# EAGLE design shift-in-midi (EAGLE 6.1)
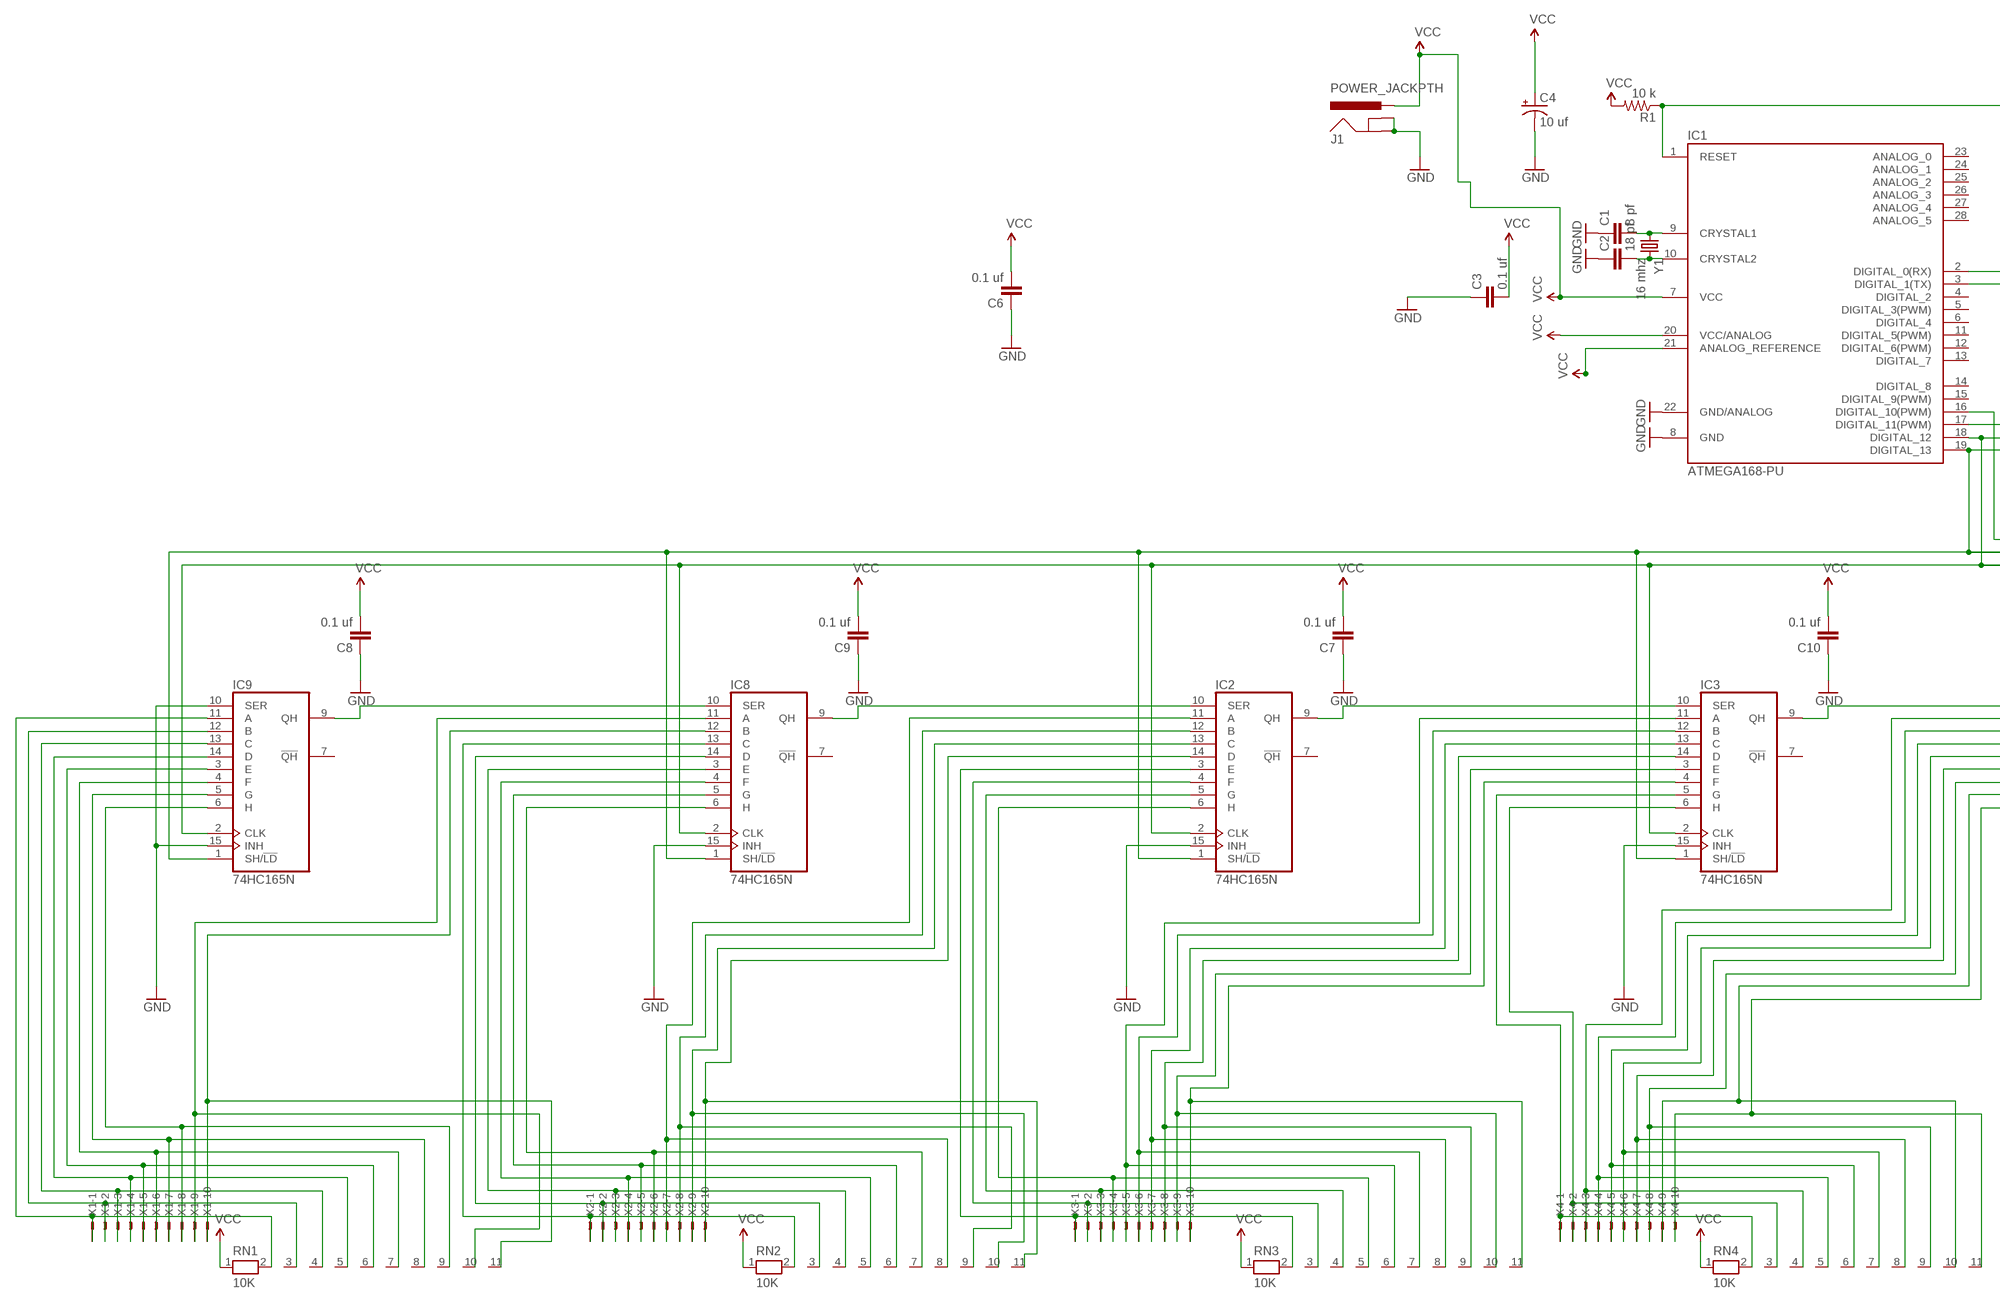
[diagram p0: schematic, sheet 1, part 1 of 2]
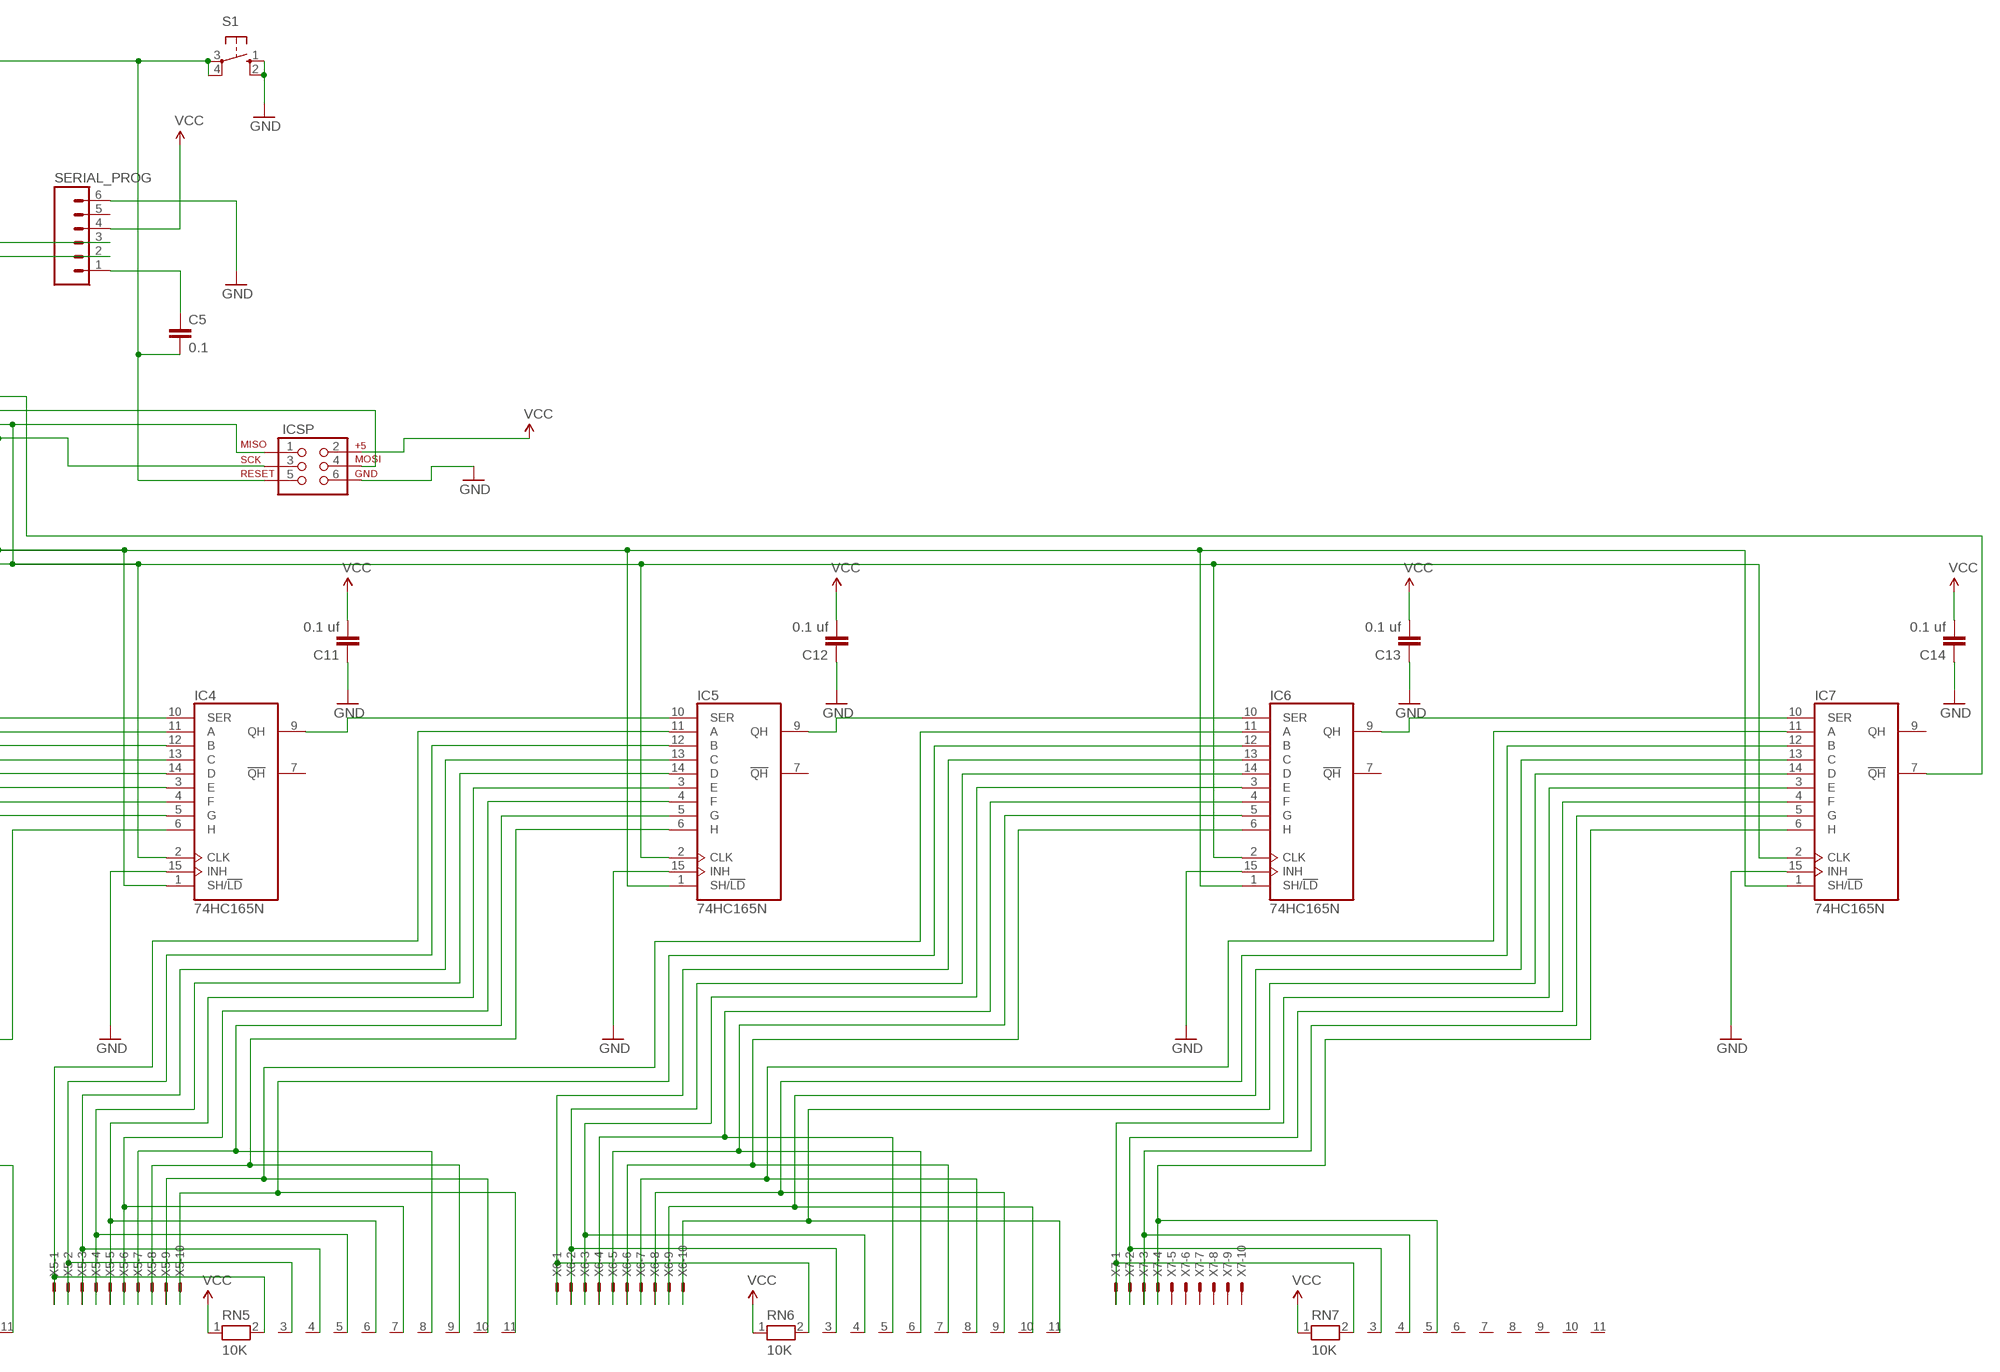
[diagram p1: schematic, sheet 1, part 2 of 2]

## Parts
C1  8 pf  CAPPTH2  [CAP-PTH-SMALL2]
C2  18 pf  CAPPTH2  [CAP-PTH-SMALL2]
C3  0.1 uf  CAPPTH2  [CAP-PTH-SMALL2]
C4  10 uf  CAP_POLPTH2  [CPOL-RADIAL-10UF-25V]
C5  0.1  CAPPTH  [CAP-PTH-SMALL]
C6  0.1 uf  CAPPTH2  [CAP-PTH-SMALL2]
C7  0.1 uf  CAPPTH2  [CAP-PTH-SMALL2]
C8  0.1 uf  CAPPTH2  [CAP-PTH-SMALL2]
C9  0.1 uf  CAPPTH2  [CAP-PTH-SMALL2]
C10  0.1 uf  CAPPTH2  [CAP-PTH-SMALL2]
C11  0.1 uf  CAPPTH2  [CAP-PTH-SMALL2]
C12  0.1 uf  CAPPTH2  [CAP-PTH-SMALL2]
C13  0.1 uf  CAPPTH2  [CAP-PTH-SMALL2]
C14  0.1 uf  CAPPTH2  [CAP-PTH-SMALL2]
IC1  ATMEGA168-PU  [DIL28-3]
IC2  74HC165N  [DIL16]
IC3  74HC165N  [DIL16]
IC4  74HC165N  [DIL16]
IC5  74HC165N  [DIL16]
IC6  74HC165N  [DIL16]
IC7  74HC165N  [DIL16]
IC8  74HC165N  [DIL16]
IC9  74HC165N  [DIL16]
ICSP  AVR_SPI_PRG_62X3_LOCK  [2X3_LOCK]
J1  POWER_JACKPTH  [POWER_JACK_PTH]
R1  10 k  RESISTORPTH-1/4W  [AXIAL-0.4]
RN1  10K  RN10  [RN-11]
RN2  10K  RN10  [RN-11]
RN3  10K  RN10  [RN-11]
RN4  10K  RN10  [RN-11]
RN5  10K  RN10  [RN-11]
RN6  10K  RN10  [RN-11]
RN7  10K  RN10  [RN-11]
S1  10-XX  [B3F-10XX]
SERIAL_PROG  M06LONGPADS  [1X06_LONGPADS]
X1  KK-156-10  [KK-156-10]
X2  KK-156-10  [KK-156-10]
X3  KK-156-10  [KK-156-10]
X4  KK-156-10  [KK-156-10]
X5  KK-156-10  [KK-156-10]
X6  KK-156-10  [KK-156-10]
X7  KK-156-10  [KK-156-10]
Y1  16 mhz  CRYSTALHC49US  [HC49US]

## Nets
GND: C1.1 C2.1 C3.1 C4.2(-) C6.1 C7.1 C8.1 C9.1 C10.1 C11.1 C12.1 C13.1 C14.1 IC1.8(GND) IC1.22(GND/ANALOG) IC2.15(INH) IC3.15(INH) IC4.15(INH) IC5.15(INH) IC6.15(INH) IC7.15(INH) IC8.15(INH) IC9.10(SER) IC9.15(INH) ICSP.6 J1.GND J1.GNDBREAK S1.1(S) S1.2(S1) SERIAL_PROG.6
N$1: C5.2 IC1.1(RESET) ICSP.5 R1.P$1 S1.3(P) S1.4(P1)
N$2: IC1.19(DIGITAL_13) IC2.1(SH/!LD) IC3.1(SH/!LD) IC4.1(SH/!LD) IC5.1(SH/!LD) IC6.1(SH/!LD) IC7.1(SH/!LD) IC8.1(SH/!LD) IC9.1(SH/!LD) ICSP.3
N$3: C1.2 IC1.9(CRYSTAL1) Y1.1
N$4: C2.2 IC1.10(CRYSTAL2) Y1.2
N$5: IC8.10(SER) IC9.9(QH)
N$6: IC2.10(SER) IC8.9(QH)
N$7: C5.1 SERIAL_PROG.1
N$8: IC1.18(DIGITAL_12) IC2.2(CLK) IC3.2(CLK) IC4.2(CLK) IC5.2(CLK) IC6.2(CLK) IC7.2(CLK) IC8.2(CLK) IC9.2(CLK) ICSP.1
N$9: IC1.2(DIGITAL_0(RX)) SERIAL_PROG.3
N$10: IC1.3(DIGITAL_1(TX)) SERIAL_PROG.2
N$11: IC2.9(QH) IC3.10(SER)
N$12: IC3.9(QH) IC4.10(SER)
N$13: IC4.9(QH) IC5.10(SER)
N$14: IC5.9(QH) IC6.10(SER)
N$15: IC6.9(QH) IC7.10(SER)
N$16: IC1.17(DIGITAL_11(PWM)) ICSP.4
N$17: IC1.16(DIGITAL_10(PWM)) IC7.7(!QH)
N$18: IC9.11(A) RN1.2 X1.1
N$19: IC9.12(B) RN1.3 X1.2
N$20: IC9.13(C) RN1.4 X1.3
N$21: IC8.12(B) RN1.11 X1.10
N$22: IC9.3(E) RN1.6 X1.5
N$23: IC9.4(F) RN1.7 X1.6
N$24: IC9.5(G) RN1.8 X1.7
N$25: IC9.6(H) RN1.9 X1.8
N$26: IC8.11(A) RN1.10 X1.9
N$28: IC8.13(C) RN2.2 X2.1
N$29: IC8.14(D) RN2.3 X2.2
N$30: IC8.3(E) RN2.4 X2.3
N$31: IC8.4(F) RN2.5 X2.4
N$32: IC8.5(G) RN2.6 X2.5
N$33: IC4.6(H) RN4.11 X4.10
N$34: IC2.11(A) RN2.8 X2.7
N$35: IC2.12(B) RN2.9 X2.8
N$36: IC2.13(C) RN2.10 X2.9
N$37: IC2.14(D) RN2.11 X2.10
N$38: IC2.3(E) RN3.2 X3.1
N$39: IC2.4(F) RN3.3 X3.2
N$40: IC2.5(G) RN3.4 X3.3
N$41: IC2.6(H) RN3.5 X3.4
N$42: IC3.11(A) RN3.6 X3.5
N$43: IC3.12(B) RN3.7 X3.6
N$44: IC3.13(C) RN3.8 X3.7
N$45: IC3.14(D) RN3.9 X3.8
N$46: IC3.3(E) RN3.10 X3.9
N$47: IC3.4(F) RN3.11 X3.10
N$48: IC3.5(G) RN4.2 X4.1
N$49: IC3.6(H) RN4.3 X4.2
N$50: IC4.11(A) RN4.4 X4.3
N$51: IC4.12(B) RN4.5 X4.4
N$52: IC4.13(C) RN4.6 X4.5
N$53: IC4.14(D) RN4.7 X4.6
N$54: IC4.3(E) RN4.8 X4.7
N$55: IC4.4(F) RN4.9 X4.8
N$56: IC4.5(G) RN4.10 X4.9
N$58: IC5.11(A) RN5.2 X5.1
N$59: IC5.12(B) RN5.3 X5.2
N$60: IC5.13(C) RN5.4 X5.3
N$61: IC5.14(D) RN5.5 X5.4
N$62: IC5.3(E) RN5.6 X5.5
N$63: IC5.4(F) RN5.7 X5.6
N$64: IC5.5(G) RN5.8 X5.7
N$65: IC5.6(H) RN5.9 X5.8
N$66: IC6.11(A) RN5.10 X5.9
N$67: IC6.12(B) RN5.11 X5.10
N$68: IC6.13(C) RN6.2 X6.1
N$69: IC6.14(D) RN6.3 X6.2
N$70: IC6.3(E) RN6.4 X6.3
N$71: IC6.4(F) RN6.5 X6.4
N$72: IC6.5(G) RN6.6 X6.5
N$73: IC6.6(H) RN6.7 X6.6
N$74: IC7.11(A) RN6.8 X6.7
N$75: IC7.12(B) RN6.9 X6.8
N$76: IC7.13(C) RN6.10 X6.9
N$77: IC7.14(D) RN6.11 X6.10
N$78: IC7.3(E) RN7.2 X7.1
N$79: IC7.4(F) RN7.3 X7.2
N$80: IC7.5(G) RN7.4 X7.3
N$81: IC7.6(H) RN7.5 X7.4
N$82: IC9.14(D) RN1.5 X1.4
N$86: IC8.6(H) RN2.7 X2.6
VCC: C3.2 C4.1(+) C6.2 C7.2 C8.2 C9.2 C10.2 C11.2 C12.2 C13.2 C14.2 IC1.7(VCC) IC1.20(VCC/ANALOG) IC1.21(ANALOG_REFERENCE) ICSP.2 J1.PWR R1.P$2 RN1.1 RN2.1 RN3.1 RN4.1 RN5.1 RN6.1 RN7.1 SERIAL_PROG.4
Unconnected: IC1.4(DIGITAL_2) IC1.5(DIGITAL_3(PWM)) IC1.6(DIGITAL_4) IC1.11(DIGITAL_5(PWM)) IC1.12(DIGITAL_6(PWM)) IC1.13(DIGITAL_7) IC1.14(DIGITAL_8) IC1.15(DIGITAL_9(PWM)) IC1.23(ANALOG_0) IC1.24(ANALOG_1) IC1.25(ANALOG_2) IC1.26(ANALOG_3) IC1.27(ANALOG_4) IC1.28(ANALOG_5) IC2.7(!QH) IC3.7(!QH) IC4.7(!QH) IC5.7(!QH) IC6.7(!QH) IC7.9(QH) IC8.7(!QH) IC9.7(!QH) RN7.6 RN7.7 RN7.8 RN7.9 RN7.10 RN7.11 SERIAL_PROG.5 X7.5 X7.6 X7.7 X7.8 X7.9 X7.10

## Power pins joined to a net without a drawn wire
GND: IC2.8(GND) IC3.8(GND) IC4.8(GND) IC5.8(GND) IC6.8(GND) IC7.8(GND) IC8.8(GND) IC9.8(GND)
VCC: IC2.16(VCC) IC3.16(VCC) IC4.16(VCC) IC5.16(VCC) IC6.16(VCC) IC7.16(VCC) IC8.16(VCC) IC9.16(VCC)

## Library data of the parts
C1-C3 C6-C14 = SparkFun:CAP: Capacitor Standard 0603 ceramic capacitor, and 0.1" leaded capacitor.
C4 = SparkFun:CAP_POL: Capacitor Polarized These are standard SMD and PTH capacitors. Normally 10uF, 47uF, and 100uF in electrolytic and tantalum varieties. Always verify the external diameter of the through hole cap, it varies with capacity, voltage, and manufacturer. The EIA devices should be standard.
C5 = SparkFun-Passives:CAP: Capacitor Standard 0603 ceramic capacitor, and 0.1" leaded capacitor.
IC1 = Arduino-AVR:ATMEGA168-PU
IC2-IC9 = 74xx-eu:74*165: 8-bit parallel load SHIFT REGISTER
ICSP = SparkFun:AVR_SPI_PRG_6: AVR ISP 6 Pin This is the reduced ISP connector for AVR programming. Common on Arduino. This footprint will take up less PCB space and can be used with a 10-pin to 6-pin adapter such as SKU: BOB-08508
J1 = SparkFun:POWER_JACK: Power Jack This is the standard 5.5mm barrel jack for power. The PTH is the most common, proven, reliable, footprint. All others are experimental. The Slot footprint only works if the mill layer is transmitted to the PCB fab house so be warned. Spark Fun Electronics SKU : PRT-00119. Mating wall wart : TOL-00298 (and others)
R1 = SparkFun:RESISTOR: Resistor Basic schematic elements and footprints for 0603, 1206, and PTH resistors.
RN1-RN7 = resistor-net:RN10: RESISTOR NETWORK; OC_FARNELL: unknown; OC_NEWARK: unknown
S1 = switch-omron:10-XX: OMRON SWITCH; MPN: B3F-1000; OC_FARNELL: 176432; OC_NEWARK: 36M3542
SERIAL_PROG = SparkFun-Connectors:M06: Header 6 Standard 6-pin 0.1" header. Use with straight break away headers (SKU : PRT-00116), right angle break away headers (PRT-00553), swiss pins (PRT-00743), machine pins (PRT-00117), and female headers (PRT-00115). Molex polarized connector foot print use with SKU : PRT-08094 with associated crimp pins and housings. NOTES ON THE VARIANTS LOCK and LOCK_LONGPADS... This footprint was designed to help hold the alignment of a through-hole component (i.e. 6-pin header) while soldering it into place. You may notice that each hole has been shifted either up or down by 0.005 of an inch from it's more standard position (which is a perfectly straight line). This slight alteration caused the pins (the squares in the middle) to touch the edges of the holes. Because they are alternating, it causes a "brace" to hold the component in place. 0.005 has proven to be the perfect amount of "off-center" position when using our standard breakaway headers. Although looks a little odd when you look at the bare footprint, once you have a header in there, the alteration is very hard to notice. Also, if you push a header all the way into place, it is covered up entirely on the bottom side. This idea of altering the position of holes to aid alignment will be further integrated into the Sparkfun Library for other footprints. It can help hold any component with 3 or more connection pins.
X1-X7 = con-molex:KK-156-10: KK 156 HEADER Source: http://www.molex.com/pdm_docs/sd/026604100_sd.pdf; OC_FARNELL: unknown; OC_NEWARK: unknown
Y1 = SparkFun:CRYSTAL: Crystals Various standard crystals. Proven footprints. Spark Fun Electronics SKU : COM-00534

## Board
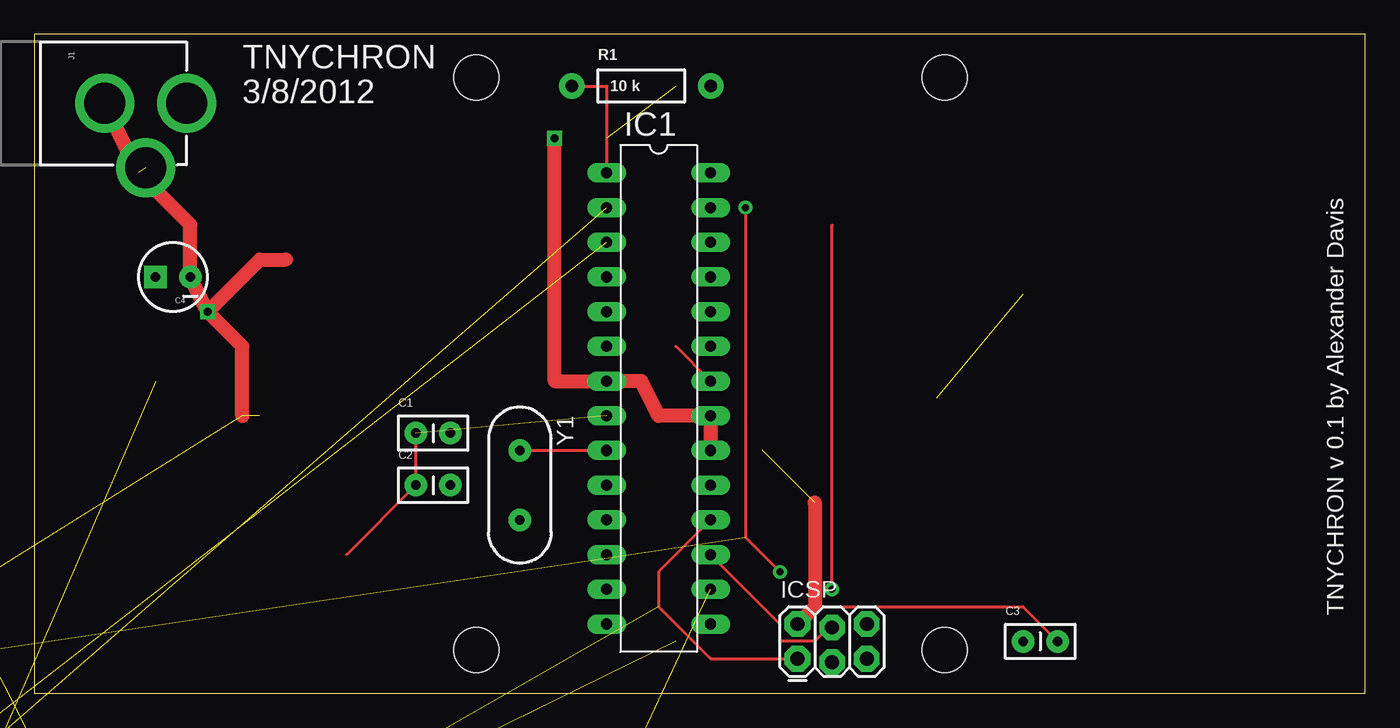
[diagram p2: board, top side]
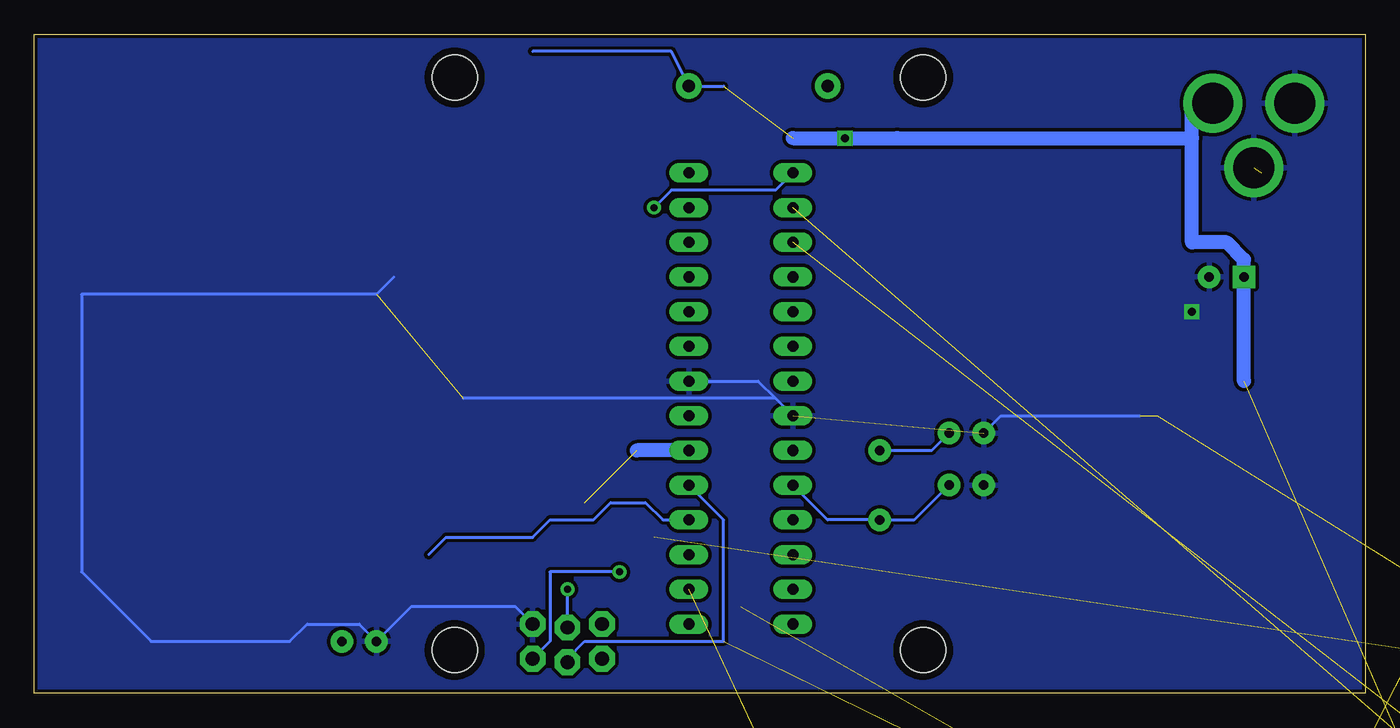
[diagram p3: board, bottom side, seen from below]

Size 97.46 x 48.25 mm. Coordinates in mm from the lower left corner, seen from the top.
Outline: 0,0 97.46,0 97.46,48.25 0,48.25 0,0
Copper layers (1*16): Top 0.035mm / dielectric 1.5mm / Bottom 0.035mm
Design rules: minimum track width 8mil, minimum drill 20mil, track to track 8mil, track to pad 8mil, pad to pad 8mil, via to via 8mil, smd to smd 8mil, copper to edge 10mil, drill to drill 8mil, minimum pad ring 12mil, minimum via ring 10mil, stop-mask expansion 4mil, vias tented up to drill 25mil, thermal gap 10mil

### Footprints (pad centres in the part's own frame; a part is rotated, then mirrored left to right if it is on the bottom)
CAP-PTH-SMALL2 = drill 0.7 pad 1.651: 1 0,0; 2 2.54,0
CPOL-RADIAL-10UF-25V = drill 0.7 pad 1.651 square: 1 1.27,0 | drill 0.7 pad 1.651: 2 -1.27,0
CAP-PTH-SMALL = drill 0.7 pad 1.651: 1 0,0; 2 2.54,0
DIL28-3 = drill 0.813 long: 1 -16.51,-3.81; 2 -13.97,-3.81; 3 -11.43,-3.81; 4 -8.89,-3.81; 5 -6.35,-3.81; 6 -3.81,-3.81; 7 -1.27,-3.81; 8 1.27,-3.81; 9 3.81,-3.81; 10 6.35,-3.81; 11 8.89,-3.81; 12 11.43,-3.81; 13 13.97,-3.81; 14 16.51,-3.81; 15 16.51,3.81; 16 13.97,3.81; 17 11.43,3.81; 18 8.89,3.81; 19 6.35,3.81; 20 3.81,3.81; 21 1.27,3.81; 22 -1.27,3.81; 23 -3.81,3.81; 24 -6.35,3.81; 25 -8.89,3.81; 26 -11.43,3.81; 27 -13.97,3.81; 28 -16.51,3.81
DIL16 = drill 0.813 long: 1 -8.89,-3.81; 2 -6.35,-3.81; 3 -3.81,-3.81; 4 -1.27,-3.81; 5 1.27,-3.81; 6 3.81,-3.81; 7 6.35,-3.81; 8 8.89,-3.81; 9 8.89,3.81; 10 6.35,3.81; 11 3.81,3.81; 12 1.27,3.81; 13 -1.27,3.81; 14 -3.81,3.81; 15 -6.35,3.81; 16 -8.89,3.81
2X3_LOCK = drill 1.016 pad 1.88 octagon: 1 0,0; 2 0,2.54; 3 2.54,-0.254; 4 2.54,2.286; 5 5.08,0; 6 5.08,2.54
POWER_JACK_PTH = drill 2.997 pad 4.318: GND 0,7.7; GNDBREAK 4.7,10.7; PWR 0,13.7
AXIAL-0.4 = drill 0.9 pad 1.88: P$1 -5.08,0; P$2 5.08,0
RN-11 = drill 0.813 long: 1 -12.7,0; 2 -10.16,0; 3 -7.62,0; 4 -5.08,0; 5 -2.54,0; 6 0,0; 7 2.54,0; 8 5.08,0; 9 7.62,0; 10 10.16,0; 11 12.7,0
B3F-10XX = drill 1.016 long: 1 -3.251,2.261; 2 3.251,2.261; 3 -3.251,-2.261; 4 3.251,-2.261
1X06_LONGPADS = drill 1.118 pad 1.88 long: 1 0,0; 2 2.54,0; 3 5.08,0; 4 7.62,0; 5 10.16,0; 6 12.7,0
STAND-OFF = hole 3.302: 0,0
KK-156-10 = drill 1.7 pad 2.184 long: 1 -17.82,0; 2 -13.86,0; 3 -9.9,0; 4 -5.94,0; 5 -1.98,0; 6 1.98,0; 7 5.94,0; 8 9.9,0; 9 13.86,0; 10 17.82,0
HC49US = drill 0.7 pad 1.651: 1 -2.54,0; 2 2.54,0

### Placement (x,y rotation side)
C1  27.94,19.05 0 top
C2  27.94,15.24 0 top
C3  72.39,3.81 0 top
C4  10.16,30.48 180 top
C5  -12.7,-11.43 0 top  (outside the outline)
C6  -11.43,-118.11 0 top  (outside the outline)
C7  -11.43,-143.51 0 top  (outside the outline)
C8  -11.43,-130.81 0 top  (outside the outline)
C9  -11.43,-137.16 0 top  (outside the outline)
C10  -11.43,-149.86 0 top  (outside the outline)
C11  -11.43,-156.21 0 top  (outside the outline)
C12  -11.43,-162.56 0 top  (outside the outline)
C13  -11.43,-168.91 0 top  (outside the outline)
C14  -11.43,-175.26 0 top  (outside the outline)
IC1  45.72,21.59 270 top
IC2  -1.27,-20.32 0 top  (outside the outline)
IC3  -1.27,-33.02 0 top  (outside the outline)
IC4  -1.27,-45.72 0 top  (outside the outline)
IC5  -1.27,-58.42 0 top  (outside the outline)
IC6  -1.27,-71.12 0 top  (outside the outline)
IC7  -1.27,-83.82 0 top  (outside the outline)
IC8  -1.27,-96.52 0 top  (outside the outline)
IC9  -1.27,-109.22 0 top  (outside the outline)
ICSP  55.88,2.54 0 top
J1  -2.54,43.18 270 top
R1  44.45,44.45 0 top
RN1  1.27,-281.94 0 top  (outside the outline)
RN2  1.27,-289.56 0 top  (outside the outline)
RN3  1.27,-297.18 0 top  (outside the outline)
RN4  1.27,-304.8 0 top  (outside the outline)
RN5  1.27,-312.42 0 top  (outside the outline)
RN6  1.27,-320.04 0 top  (outside the outline)
RN7  1.27,-327.66 0 top  (outside the outline)
S1  -8.89,5.08 0 top  (outside the outline)
SERIAL_PROG  -11.43,-6.35 0 top  (outside the outline)
U$4  [STAND-OFF]  66.67,45.08 0 top
U$5  [STAND-OFF]  32.38,45.08 0 top
U$6  [STAND-OFF]  32.38,3.18 0 top
U$7  [STAND-OFF]  66.67,3.18 0 top
X1  8.89,-184.15 0 top  (outside the outline)
X2  8.89,-194.31 0 top  (outside the outline)
X3  8.89,-204.47 0 top  (outside the outline)
X4  8.89,-214.63 0 top  (outside the outline)
X5  8.89,-224.79 0 top  (outside the outline)
X6  8.89,-234.95 0 top  (outside the outline)
X7  8.89,-246.38 0 top  (outside the outline)
Y1  35.56,15.24 270 top

### Tracks (layer width: path | path; a pad name or v marks a point on that pad's centre or on a via)
GND  (via drill 0.6)  (33 unrouted)
  Top 0.203: 22.86,10.16 C2.1 C1.1 | IC1.22 46.99,25.4
  Top 1.016: 15.24,20.32 15.24,25.4 v12.7,27.94 | v12.7,27.94 C4.2 11.43,34.29 7.62,38.1 J1.GND | v12.7,27.94 16.51,31.75 18.41,31.75
  Bottom 0.203: 16.51,20.32 26.67,20.32 C1.1 | ICSP.6 62.23,6.35 69.85,6.35 C3.1 73.66,5.08 77.47,5.08 78.74,3.81 88.9,3.81 93.98,8.89 93.98,29.21 72.39,29.21 71.12,30.48 | 43.18,21.59 44.45,22.86 IC1.22 | 43.18,21.59 IC1.8 | 43.18,21.59 66.04,21.59
  pour Bottom (isolate 0.254): -1.27,49.53 100.33,49.53 100.33,44.45 100.33,-1.27 -1.27,-1.27 -1.27,0
N$1  (via drill 0.51)  (3 unrouted)
  Top 0.203: IC1.1 41.91,44.45 R1.P$1 | v54.61,8.89 52.07,11.43 v52.07,35.56
  Bottom 0.203: ICSP.5 59.69,3.81 59.69,8.89 v54.61,8.89 | v52.07,35.56 50.8,36.83 43.18,36.83 IC1.1
N$2  (8 unrouted)
  Bottom 0.203: IC1.19 46.99,12.7 46.99,3.81 57.15,3.81 58.42,2.54 ICSP.3
N$3
  Top 0.203: Y1.1 IC1.9
  Bottom 0.203: C1.2 31.75,17.78 Y1.1
N$4
  Bottom 0.203: IC1.10 39.37,12.7 Y1.2 33.02,12.7 C2.2
N$5  (1 unrouted)
N$6  (1 unrouted)
N$7  (1 unrouted)
N$8  (8 unrouted)
  Top 0.203: ICSP.1 49.53,2.54 45.72,6.35 45.72,8.89 IC1.18
  Bottom 0.203: IC1.18 51.44,12.7 52.71,13.97 55.25,13.97 56.52,12.7 59.69,12.7 60.96,11.43 67.31,11.43 68.58,10.16
N$9  (1 unrouted)
N$10  (1 unrouted)
N$11  (1 unrouted)
N$12  (1 unrouted)
N$13  (1 unrouted)
N$14  (1 unrouted)
N$15  (1 unrouted)
N$16  (via drill 0.51)
  Top 0.203: IC1.17 54.61,5.08 54.61,3.81 57.15,3.81 58.42,5.08 ICSP.4 | v58.42,7.62 58.42,34.29
  Bottom 0.203: ICSP.4 v58.42,7.62
N$17  (1 unrouted)
N$18  (2 unrouted)
N$19  (2 unrouted)
N$20  (2 unrouted)
N$21  (2 unrouted)
N$22  (2 unrouted)
N$23  (2 unrouted)
N$24  (2 unrouted)
N$25  (2 unrouted)
N$26  (2 unrouted)
N$28  (2 unrouted)
N$29  (2 unrouted)
N$30  (2 unrouted)
N$31  (2 unrouted)
N$32  (2 unrouted)
N$33  (2 unrouted)
N$34  (2 unrouted)
N$35  (2 unrouted)
N$36  (2 unrouted)
N$37  (2 unrouted)
N$38  (2 unrouted)
N$39  (2 unrouted)
N$40  (2 unrouted)
N$41  (2 unrouted)
N$42  (2 unrouted)
N$43  (2 unrouted)
N$44  (2 unrouted)
N$45  (2 unrouted)
N$46  (2 unrouted)
N$47  (2 unrouted)
N$48  (2 unrouted)
N$49  (2 unrouted)
N$50  (2 unrouted)
N$51  (2 unrouted)
N$52  (2 unrouted)
N$53  (2 unrouted)
N$54  (2 unrouted)
N$55  (2 unrouted)
N$56  (2 unrouted)
N$58  (2 unrouted)
N$59  (2 unrouted)
N$60  (2 unrouted)
N$61  (2 unrouted)
N$62  (2 unrouted)
N$63  (2 unrouted)
N$64  (2 unrouted)
N$65  (2 unrouted)
N$66  (2 unrouted)
N$67  (2 unrouted)
N$68  (2 unrouted)
N$69  (2 unrouted)
N$70  (2 unrouted)
N$71  (2 unrouted)
N$72  (2 unrouted)
N$73  (2 unrouted)
N$74  (2 unrouted)
N$75  (2 unrouted)
N$76  (2 unrouted)
N$77  (2 unrouted)
N$78  (2 unrouted)
N$79  (2 unrouted)
N$80  (2 unrouted)
N$81  (2 unrouted)
N$82  (2 unrouted)
N$86  (2 unrouted)
VCC  (via drill 0.6)  (27 unrouted)
  Top 0.203: C3.2 72.39,6.35 57.15,6.35
  Top 1.016: ICSP.2 57.15,6.35 57.15,13.97 | IC1.20 IC1.21 45.72,20.32 44.45,22.86 IC1.7 38.1,22.86 v38.1,40.64
  Bottom 0.203: 46.99,44.45 R1.P$2 50.8,46.99 60.96,46.99
  Bottom 1.016: IC1.20 53.34,17.78 | 41.91,40.64 v38.1,40.64 | v38.1,40.64 34.29,40.64 | 12.7,40.64 12.7,33.02 10.16,33.02 8.89,31.75 C4.1 8.89,22.86 | 12.7,40.64 12.7,43.18 J1.PWR | v38.1,40.64 12.7,40.64

### Text on the board
tSilk: TNYCHRON | 3/8/2012 | TNYCHRON v 0.1 by Alexander Davis